# EAGLE schematic MotherboardRev1 (EAGLE 7.2.0)

## Sheet 1 of 9
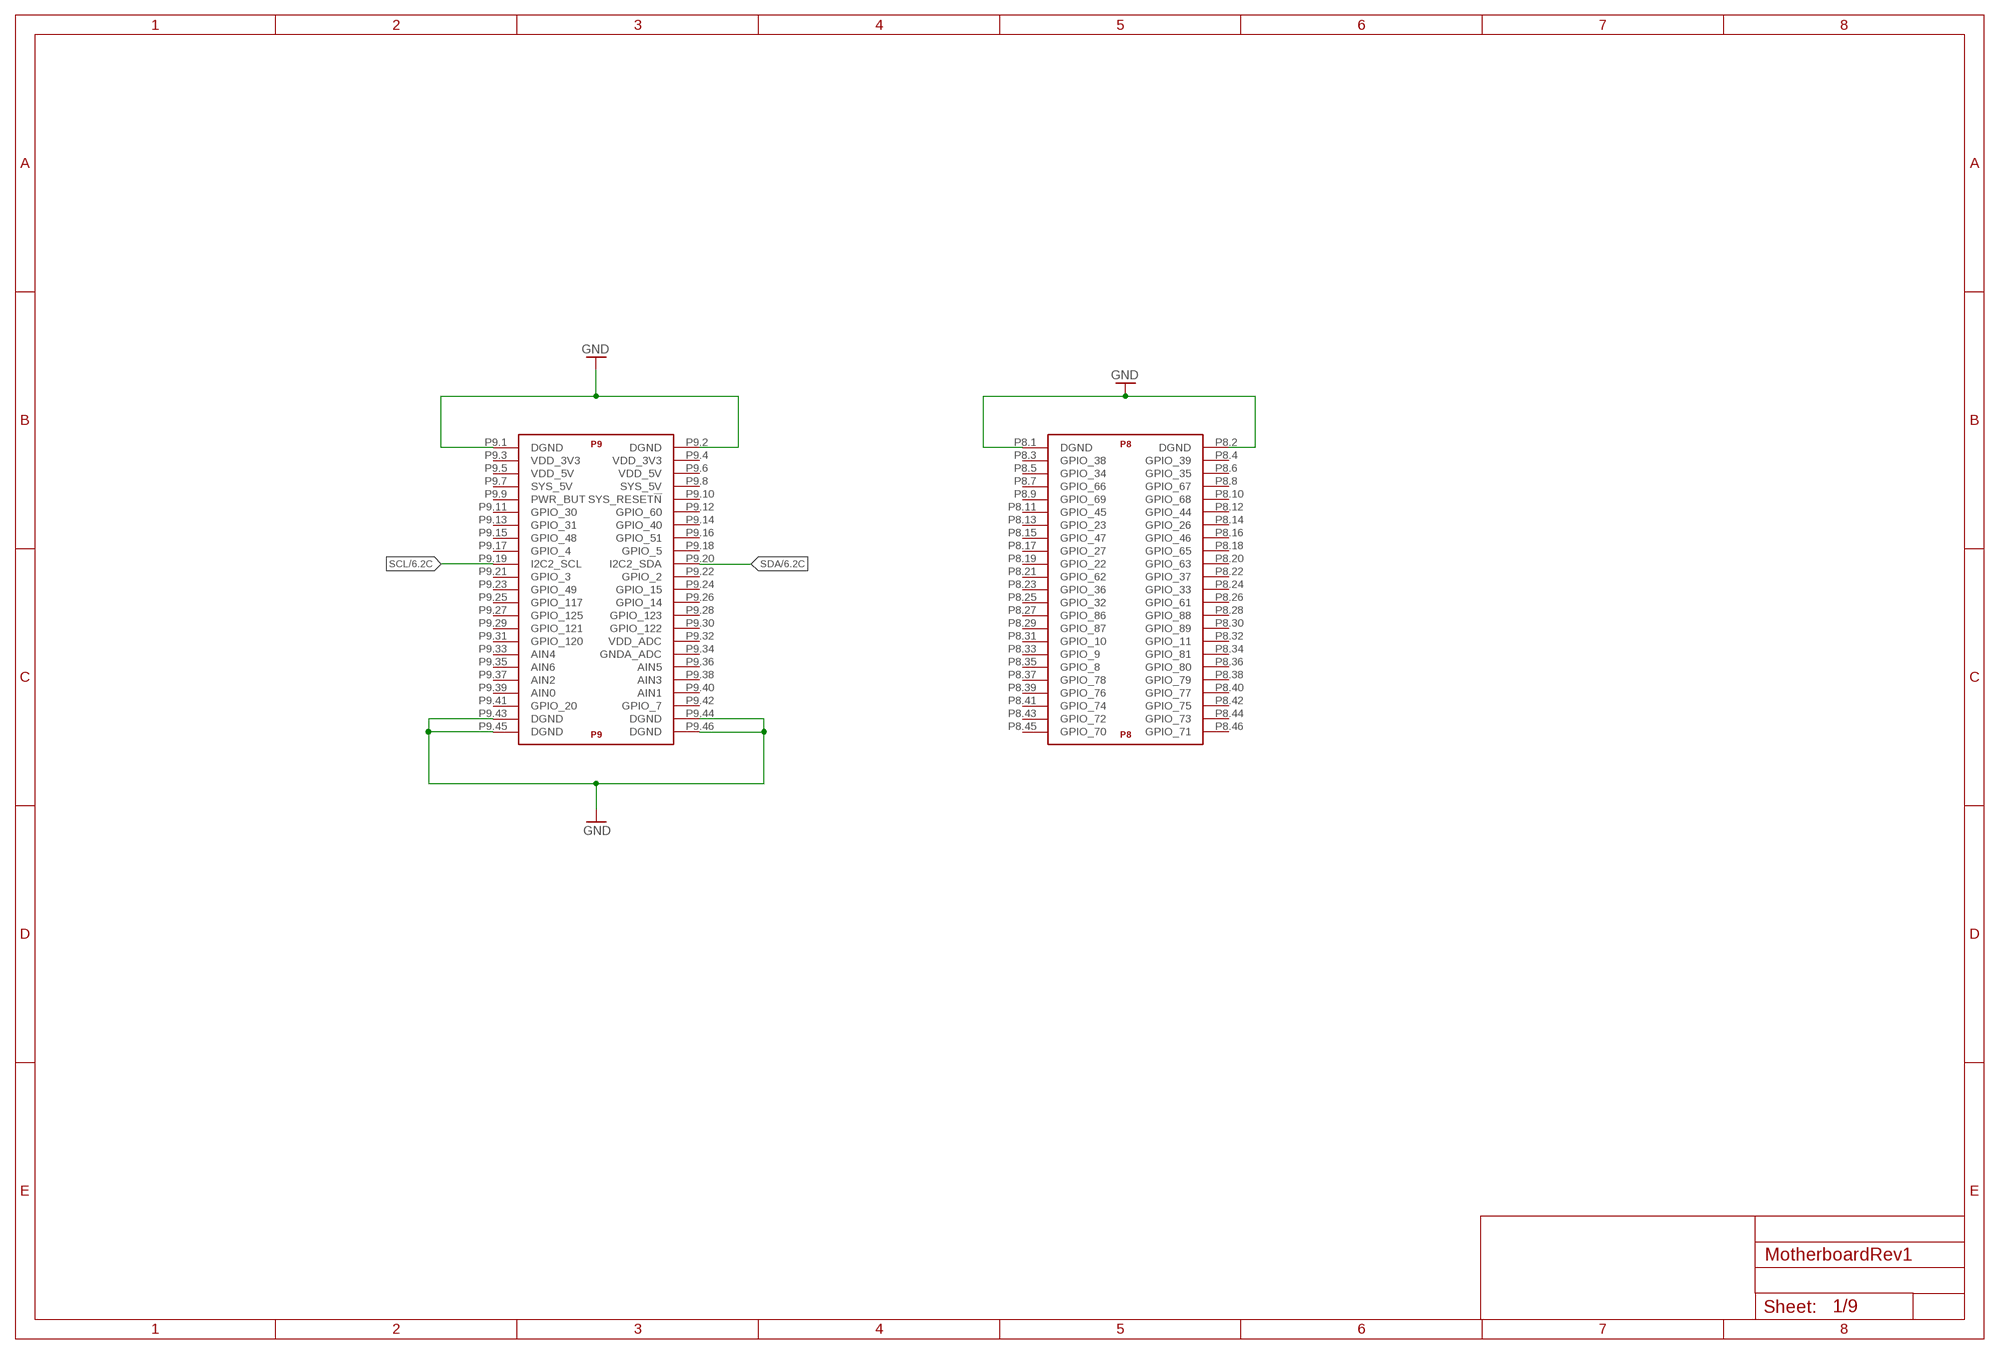
[diagram p0: schematic, sheet 1]

### Parts
U$1  BEAGLE_BONE_BLACK_CAPE  [BEAGLE_BONE_BLACK_CAPE]

### Nets
GND: U$1.P8.1(P8:DGND) U$1.P8.2(P8:DGND) U$1.P9.1(P9:DGND) U$1.P9.2(P9:DGND) U$1.P9.43(P9:DGND) U$1.P9.44(P9:DGND) U$1.P9.45(P9:DGND) U$1.P9.46(P9:DGND) ; also sheet 2,3,4,5,6,8,9
SCL: U$1.P9.19(P9:I2C2_SCL) ; also sheet 6,9
SDA: U$1.P9.20(P9:I2C2_SDA) ; also sheet 6,9
Unconnected: U$1.P8.3(P8:GPIO_38) U$1.P8.4(P8:GPIO_39) U$1.P8.5(P8:GPIO_34) U$1.P8.6(P8:GPIO_35) U$1.P8.7(P8:GPIO_66) U$1.P8.8(P8:GPIO_67) U$1.P8.9(P8:GPIO_69) U$1.P8.10(P8:GPIO_68) U$1.P8.11(P8:GPIO_45) U$1.P8.12(P8:GPIO_44) U$1.P8.13(P8:GPIO_23) U$1.P8.14(P8:GPIO_26) U$1.P8.15(P8:GPIO_47) U$1.P8.16(P8:GPIO_46) U$1.P8.17(P8:GPIO_27) U$1.P8.18(P8:GPIO_65) U$1.P8.19(P8:GPIO_22) U$1.P8.20(P8:GPIO_63) U$1.P8.21(P8:GPIO_62) U$1.P8.22(P8:GPIO_37) U$1.P8.23(P8:GPIO_36) U$1.P8.24(P8:GPIO_33) U$1.P8.25(P8:GPIO_32) U$1.P8.26(P8:GPIO_61) U$1.P8.27(P8:GPIO_86) U$1.P8.28(P8:GPIO_88) U$1.P8.29(P8:GPIO_87) U$1.P8.30(P8:GPIO_89) U$1.P8.31(P8:GPIO_10) U$1.P8.32(P8:GPIO_11) U$1.P8.33(P8:GPIO_9) U$1.P8.34(P8:GPIO_81) U$1.P8.35(P8:GPIO_8) U$1.P8.36(P8:GPIO_80) U$1.P8.37(P8:GPIO_78) U$1.P8.38(P8:GPIO_79) U$1.P8.39(P8:GPIO_76) U$1.P8.40(P8:GPIO_77) U$1.P8.41(P8:GPIO_74) U$1.P8.42(P8:GPIO_75) U$1.P8.43(P8:GPIO_72) U$1.P8.44(P8:GPIO_73) U$1.P8.45(P8:GPIO_70) U$1.P8.46(P8:GPIO_71) U$1.P9.3(P9:VDD_3V3) U$1.P9.4(P9:VDD_3V3) U$1.P9.5(P9:VDD_5V) U$1.P9.6(P9:VDD_5V) U$1.P9.7(P9:SYS_5V) U$1.P9.8(P9:SYS_5V) U$1.P9.9(P9:PWR_BUT) U$1.P9.10(P9:SYS_RESET!N) U$1.P9.11(P9:GPIO_30) U$1.P9.12(P9:GPIO_60) U$1.P9.13(P9:GPIO_31) U$1.P9.14(P9:GPIO_40) U$1.P9.15(P9:GPIO_48) U$1.P9.16(P9:GPIO_51) U$1.P9.17(P9:GPIO_4) U$1.P9.18(P9:GPIO_5) U$1.P9.21(P9:GPIO_3) U$1.P9.22(P9:GPIO_2) U$1.P9.23(P9:GPIO_49) U$1.P9.24(P9:GPIO_15) U$1.P9.25(P9:GPIO_117) U$1.P9.26(P9:GPIO_14) U$1.P9.27(P9:GPIO_125) U$1.P9.28(P9:GPIO_123) U$1.P9.29(P9:GPIO_121) U$1.P9.30(P9:GPIO_122) U$1.P9.31(P9:GPIO_120) U$1.P9.32(P9:VDD_ADC) U$1.P9.33(P9:AIN4) U$1.P9.34(P9:GNDA_ADC) U$1.P9.35(P9:AIN6) U$1.P9.36(P9:AIN5) U$1.P9.37(P9:AIN2) U$1.P9.38(P9:AIN3) U$1.P9.39(P9:AIN0) U$1.P9.40(P9:AIN1) U$1.P9.41(P9:GPIO_20) U$1.P9.42(P9:GPIO_7)

## Sheet 2 of 9
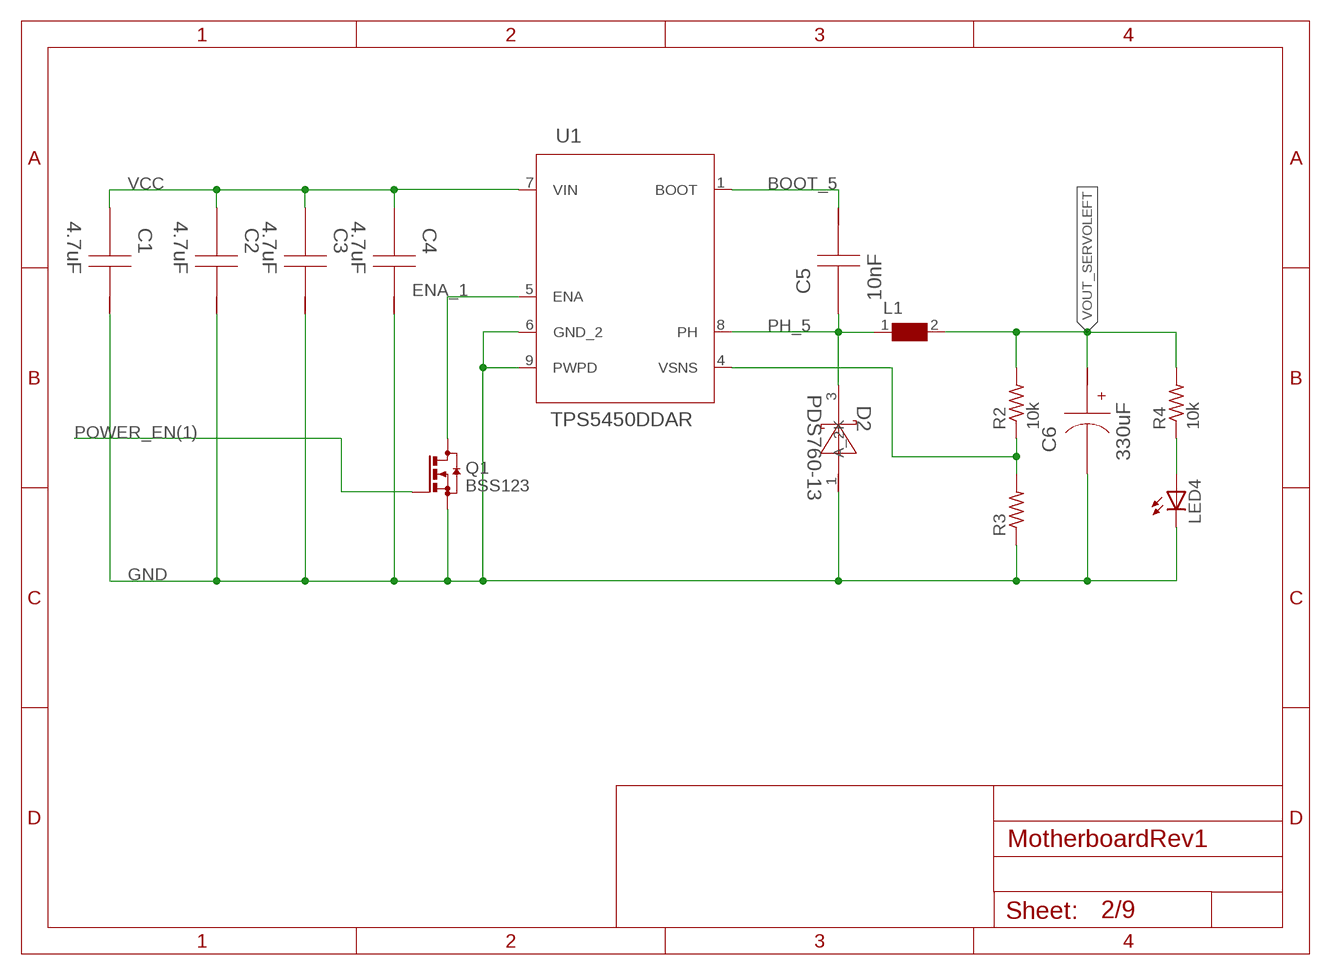
[diagram p1: schematic, sheet 2]

### Parts
C1  4.7uF  GRM31CR71H475KA12L  [1206]
C2  4.7uF  GRM31CR71H475KA12L  [1206]
C3  4.7uF  GRM31CR71H475KA12L  [1206]
C4  4.7uF  GRM31CR71H475KA12L  [1206]
C5  10nF  C0805C103K5RACTU  [0805]
C6  330uF  10SVP330MX  [SM_RADIAL_10AMM]
D2  PDS760-13  [POWERDI5]
L1  WE-HCC-7443331000_1090  [WE-HCC_1090]
LED4  LEDSML1206  [SML1206]
Q1  BSS123  [SOT23]
R2  10k  R-US_R1206  [R1206]
R3  R-US_R1206  [R1206]
R4  10k  R-US_R1206  [R1206]
U1  TPS5450DDAR  [R-PDSO-G8]

### Nets
BOOT_5: C5.1 U1.1(BOOT) ; also sheet 4
ENA_1: Q1.3(D) U1.5(ENA)
GND: C1.1 C2.1 C3.1 C4.1 C6.2(-) D2.1(A_2) LED4.C Q1.2(S) R3.1 U1.6(GND_2) U1.9(PWPD) ; also sheet 1,3,4,5,6,8,9
N$2: LED4.A R4.1
PH_5: C5.2 D2.3(K) L1.1 U1.8(PH) ; also sheet 4
POWER_EN(1): Q1.1(G)
VCC: C1.2 C2.2 C3.2 C4.2 U1.7(VIN) ; also sheet 3,4,5
VOUT_SERVOLEFT: C6.1(+) L1.2 R2.2 R4.2 ; also sheet 8
VSNS_5: R2.1 R3.2 U1.4(VSNS)

## Sheet 3 of 9
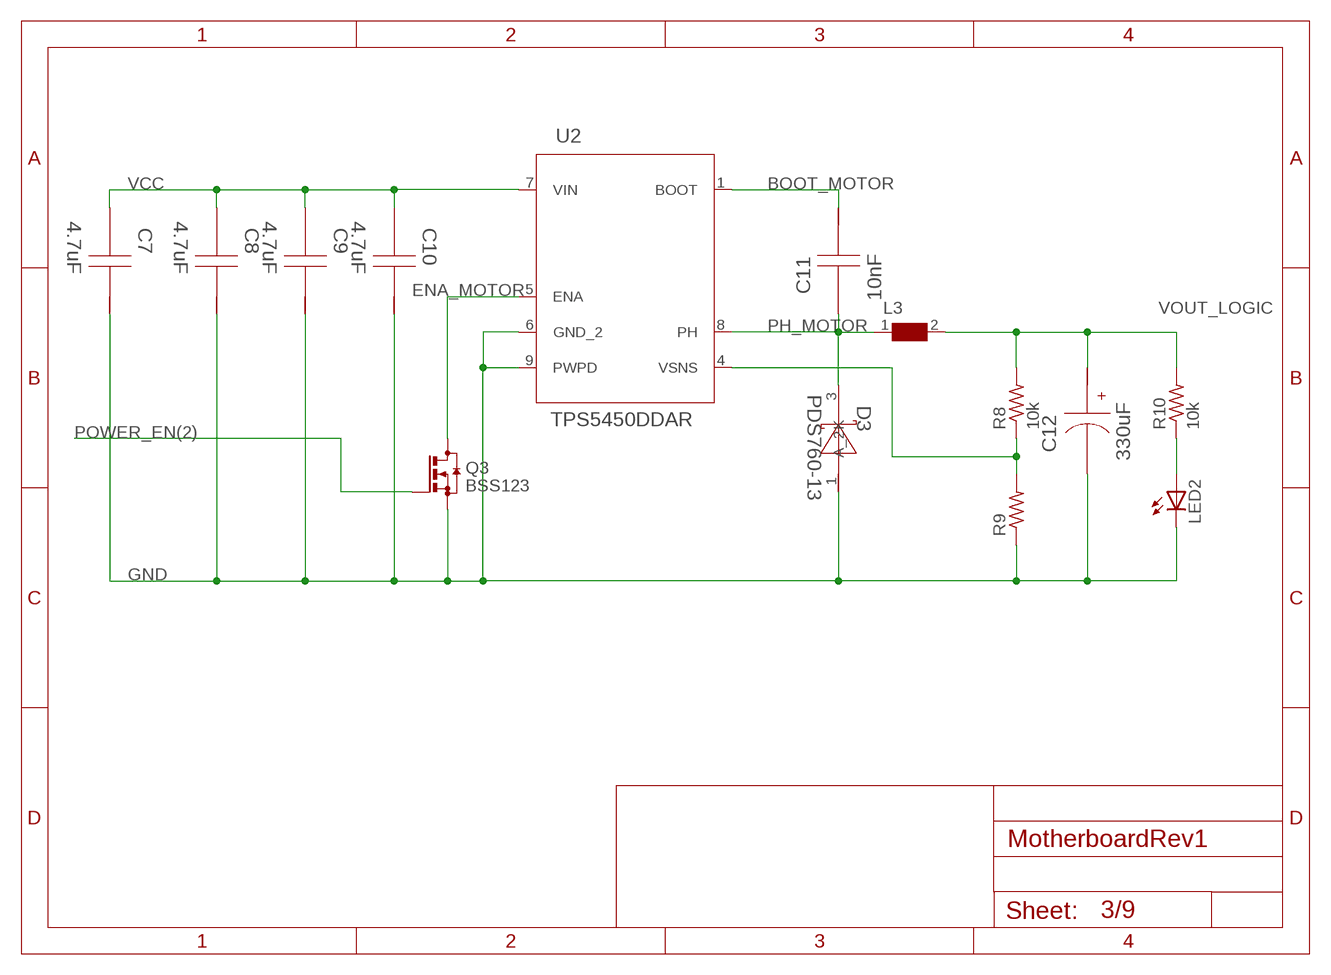
[diagram p2: schematic, sheet 3]

### Parts
C7  4.7uF  GRM31CR71H475KA12L  [1206]
C8  4.7uF  GRM31CR71H475KA12L  [1206]
C9  4.7uF  GRM31CR71H475KA12L  [1206]
C10  4.7uF  GRM31CR71H475KA12L  [1206]
C11  10nF  C0805C103K5RACTU  [0805]
C12  330uF  10SVP330MX  [SM_RADIAL_10AMM]
D3  PDS760-13  [POWERDI5]
L3  WE-HCC-7443331000_1090  [WE-HCC_1090]
LED2  LEDSML1206  [SML1206]
Q3  BSS123  [SOT23]
R8  10k  R-US_R1206  [R1206]
R9  R-US_R1206  [R1206]
R10  10k  R-US_R1206  [R1206]
U2  TPS5450DDAR  [R-PDSO-G8]

### Nets
BOOT_MOTOR: C11.1 U2.1(BOOT) ; also sheet 5
ENA_MOTOR: Q3.3(D) U2.5(ENA) ; also sheet 5
GND: C7.1 C8.1 C9.1 C10.1 C12.2(-) D3.1(A_2) LED2.C Q3.2(S) R9.1 U2.6(GND_2) U2.9(PWPD) ; also sheet 1,2,4,5,6,8,9
N$4: LED2.A R10.1
PH_MOTOR: C11.2 D3.3(K) L3.1 U2.8(PH) ; also sheet 5
POWER_EN(2): Q3.1(G)
VCC: C7.2 C8.2 C9.2 C10.2 U2.7(VIN) ; also sheet 2,4,5
VOUT_LOGIC: C12.1(+) L3.2 R8.2 R10.2
VSNS1_MOTOR: R8.1 R9.2 U2.4(VSNS)

## Sheet 4 of 9
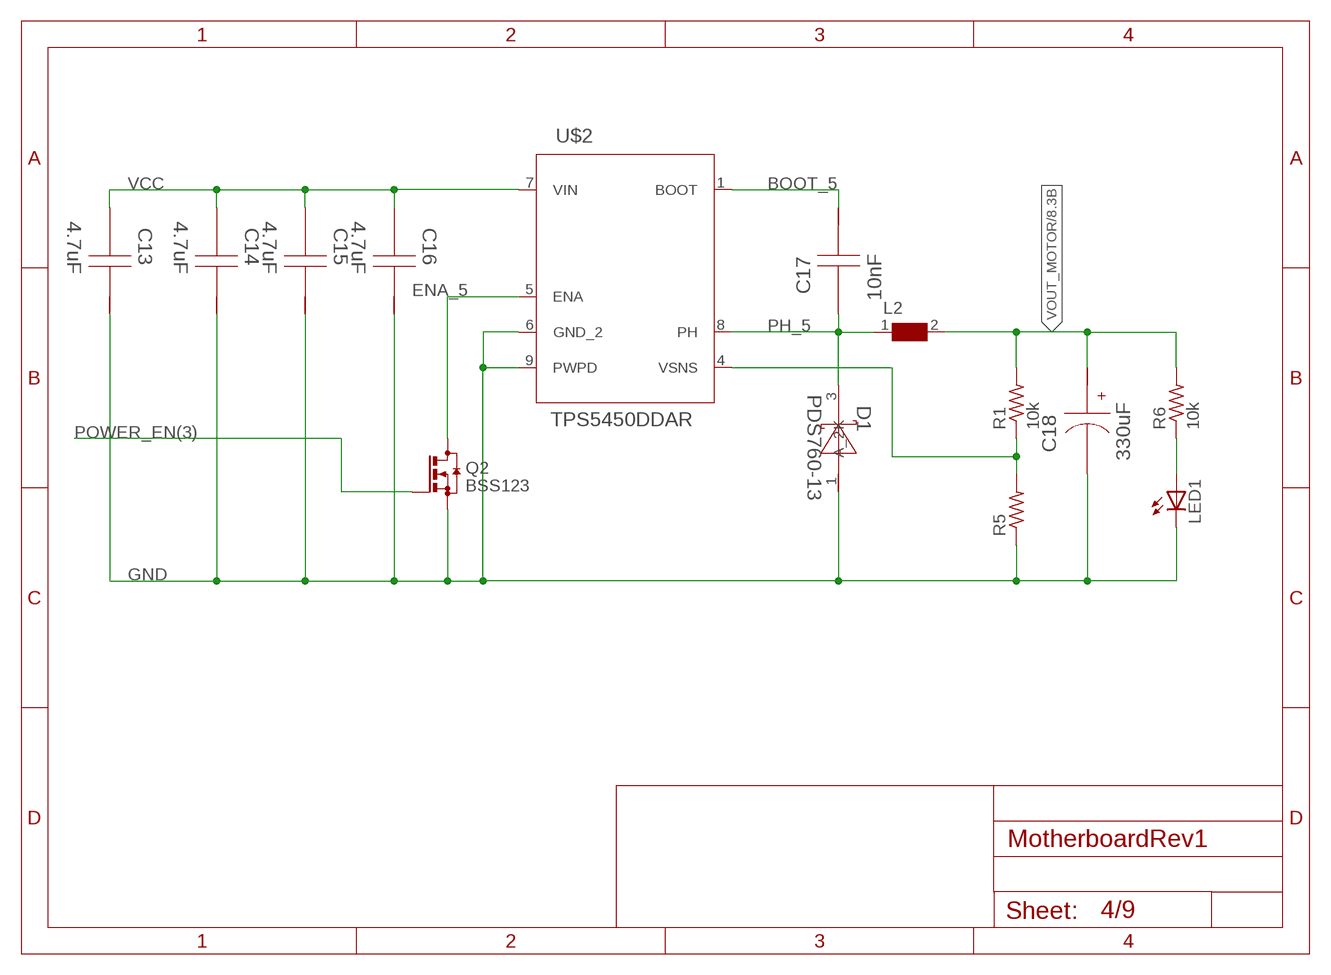
[diagram p3: schematic, sheet 4]

### Parts
C13  4.7uF  GRM31CR71H475KA12L  [1206]
C14  4.7uF  GRM31CR71H475KA12L  [1206]
C15  4.7uF  GRM31CR71H475KA12L  [1206]
C16  4.7uF  GRM31CR71H475KA12L  [1206]
C17  10nF  C0805C103K5RACTU  [0805]
C18  330uF  10SVP330MX  [SM_RADIAL_10AMM]
D1  PDS760-13  [POWERDI5]
L2  WE-HCC-7443331000_1090  [WE-HCC_1090]
LED1  LEDSML1206  [SML1206]
Q2  BSS123  [SOT23]
R1  10k  R-US_R1206  [R1206]
R5  R-US_R1206  [R1206]
R6  10k  R-US_R1206  [R1206]
U$2  TPS5450DDAR  [R-PDSO-G8]

### Nets
BOOT_5: C17.1 U$2.1(BOOT) ; also sheet 2
ENA_5: Q2.3(D) U$2.5(ENA)
GND: C13.1 C14.1 C15.1 C16.1 C18.2(-) D1.1(A_2) LED1.C Q2.2(S) R5.1 U$2.6(GND_2) U$2.9(PWPD) ; also sheet 1,2,3,5,6,8,9
N$1: LED1.A R6.1
PH_5: C17.2 D1.3(K) L2.1 U$2.8(PH) ; also sheet 2
POWER_EN(3): Q2.1(G)
VCC: C13.2 C14.2 C15.2 C16.2 U$2.7(VIN) ; also sheet 2,3,5
VOUT_MOTOR: C18.1(+) L2.2 R1.2 R6.2 ; also sheet 8
VSNS_1: R1.1 R5.2 U$2.4(VSNS)

## Sheet 5 of 9
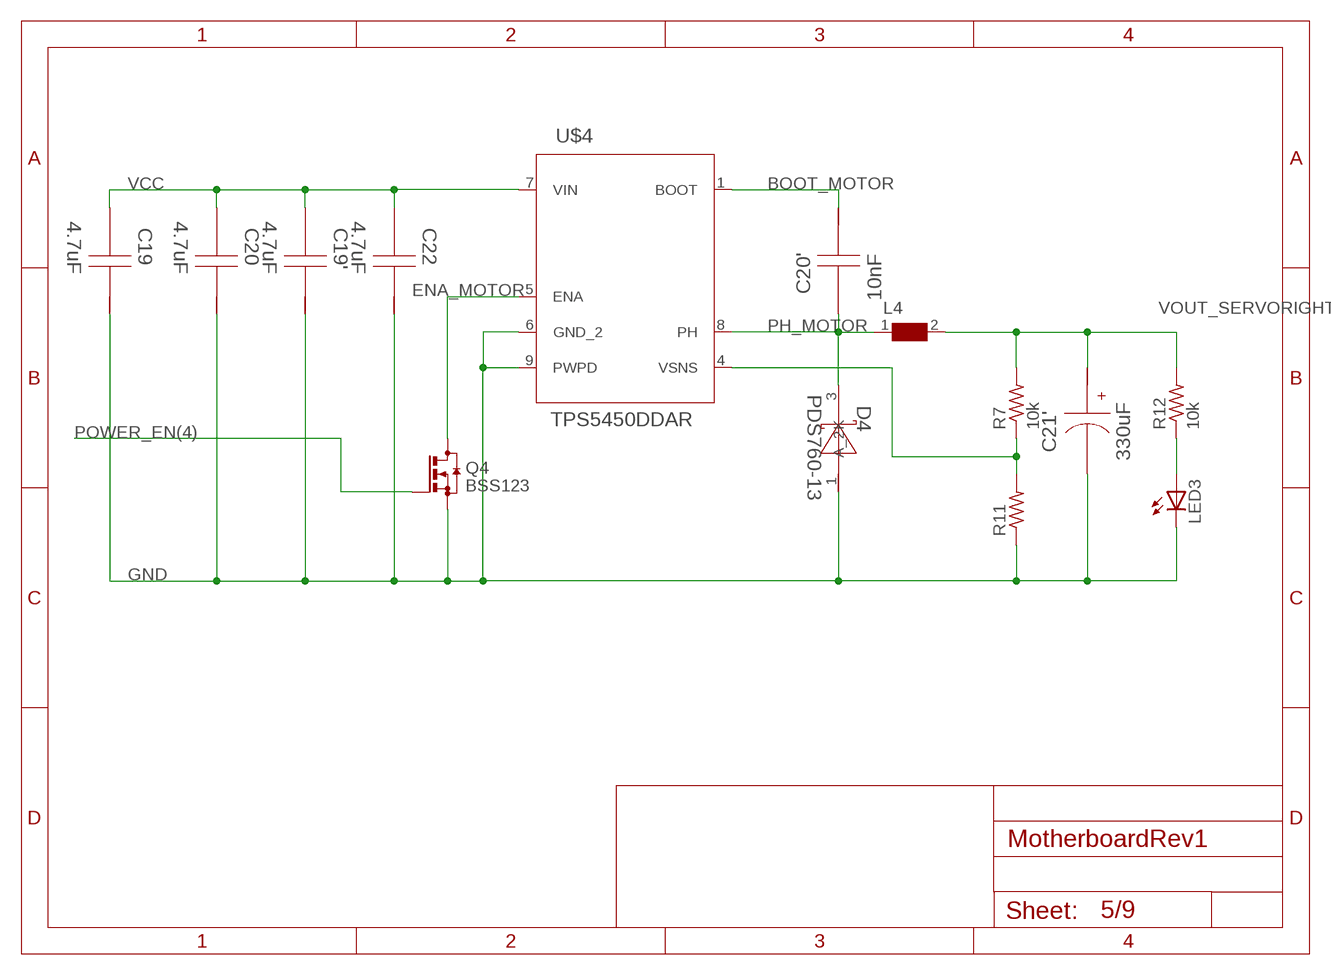
[diagram p4: schematic, sheet 5]

### Parts
C19  4.7uF  GRM31CR71H475KA12L  [1206]
C19'  4.7uF  GRM31CR71H475KA12L  [1206]
C20  4.7uF  GRM31CR71H475KA12L  [1206]
C20'  10nF  C0805C103K5RACTU  [0805]
C21'  330uF  10SVP330MX  [SM_RADIAL_10AMM]
C22  4.7uF  GRM31CR71H475KA12L  [1206]
D4  PDS760-13  [POWERDI5]
L4  WE-HCC-7443331000_1090  [WE-HCC_1090]
LED3  LEDSML1206  [SML1206]
Q4  BSS123  [SOT23]
R7  10k  R-US_R1206  [R1206]
R11  R-US_R1206  [R1206]
R12  10k  R-US_R1206  [R1206]
U$4  TPS5450DDAR  [R-PDSO-G8]

### Nets
BOOT_MOTOR: C20'.1 U$4.1(BOOT) ; also sheet 3
ENA_MOTOR: Q4.3(D) U$4.5(ENA) ; also sheet 3
GND: C19'.1 C19.1 C20.1 C21'.2(-) C22.1 D4.1(A_2) LED3.C Q4.2(S) R11.1 U$4.6(GND_2) U$4.9(PWPD) ; also sheet 1,2,3,4,6,8,9
N$3: LED3.A R12.1
PH_MOTOR: C20'.2 D4.3(K) L4.1 U$4.8(PH) ; also sheet 3
POWER_EN(4): Q4.1(G)
VCC: C19'.2 C19.2 C20.2 C22.2 U$4.7(VIN) ; also sheet 2,3,4
VOUT_SERVORIGHT: C21'.1(+) L4.2 R7.2 R12.2 ; also sheet 8
VSNS1_MOTOR1: R7.1 R11.2 U$4.4(VSNS)

## Sheet 6 of 9
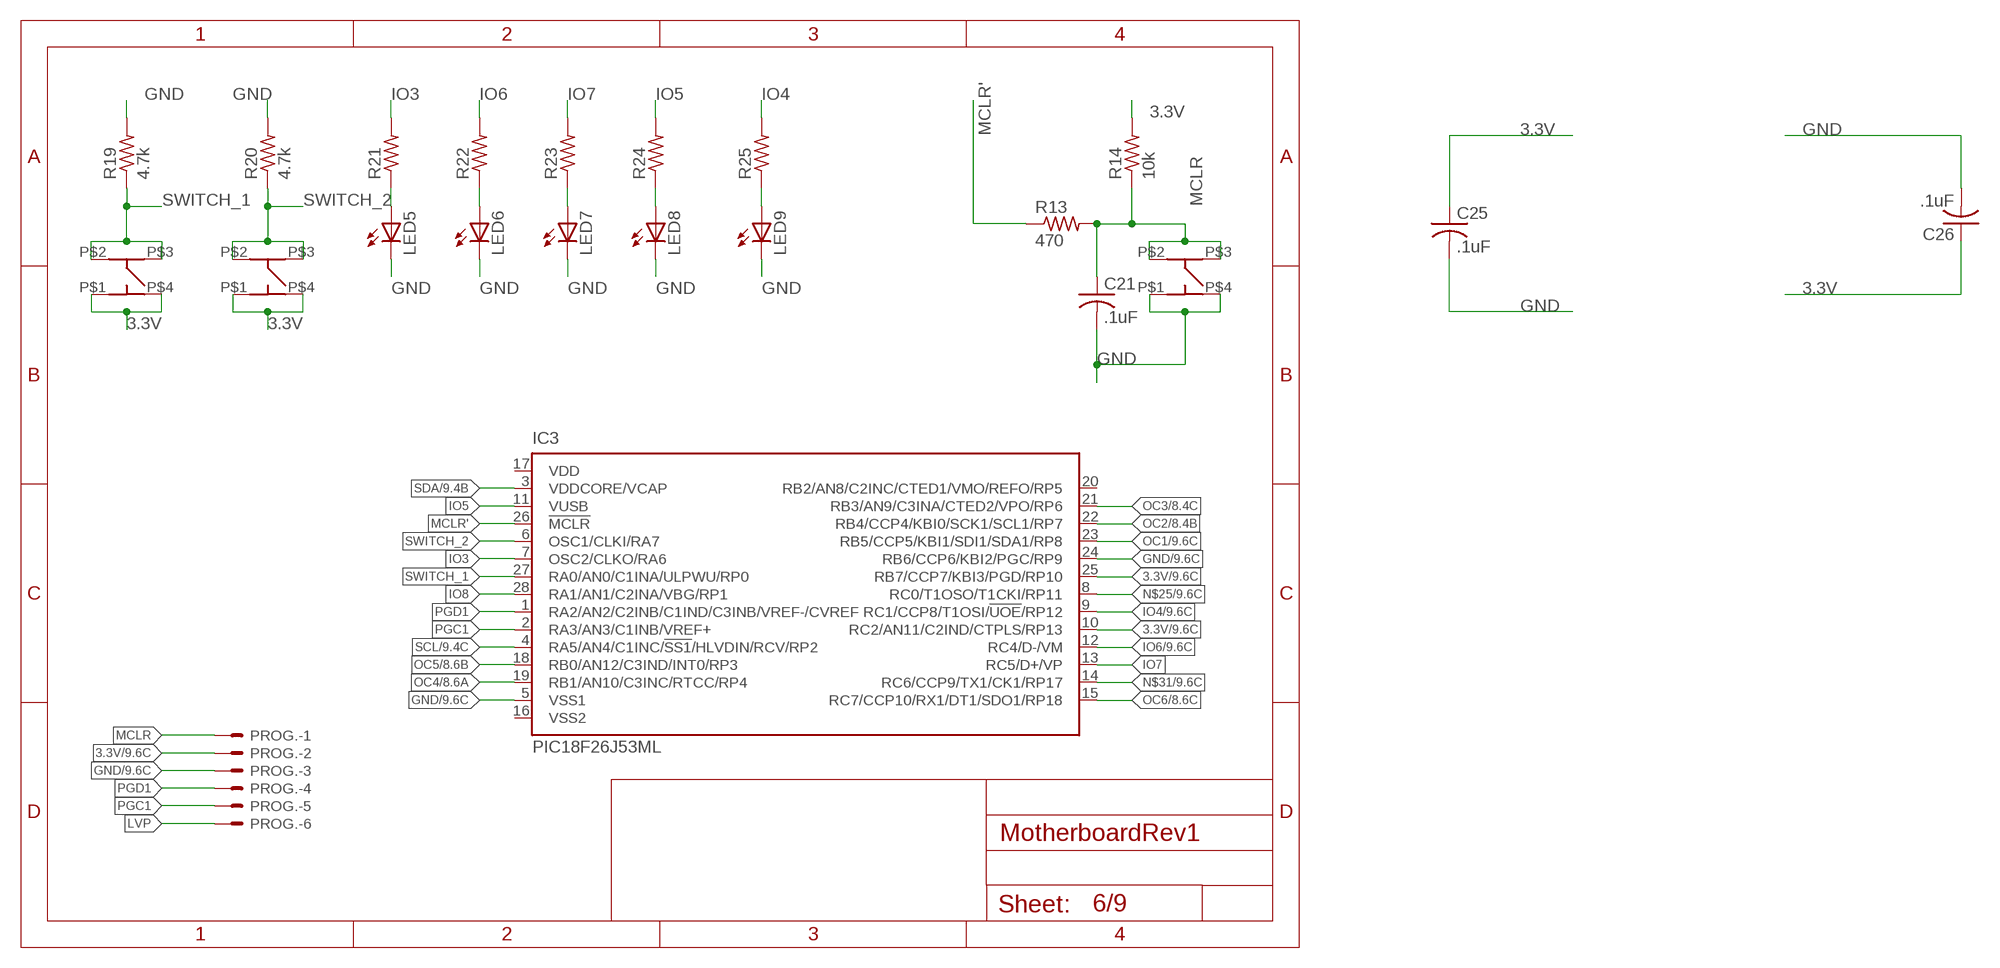
[diagram p5: schematic, sheet 6]

### Parts
C21  .1uF  C-USC0805  [C0805]
C25  .1uF  C-USC0805  [C0805]
C26  .1uF  C-USC0805  [C0805]
IC3  PIC18F26J53ML  [QFN28-ML_6X6MM]
LED5  LED_LEDCHIPLED_1206  [LED_CHIPLED_1206]
LED6  LED_LEDCHIPLED_1206  [LED_CHIPLED_1206]
LED7  LED_LEDCHIPLED_1206  [LED_CHIPLED_1206]
LED8  LED_LEDCHIPLED_1206  [LED_CHIPLED_1206]
LED9  LED_LEDCHIPLED_1206  [LED_CHIPLED_1206]
PROG.  22-23-2061  [22-23-2061]
R13  470  R-US_R0805  [R0805]
R14  10k  R-US_R0805  [R0805]
R19  4.7k  R-US_R0805  [R0805]
R20  4.7k  R-US_R0805  [R0805]
R21  R-US_M0805  [M0805]
R22  R-US_M0805  [M0805]
R23  R-US_M0805  [M0805]
R24  R-US_M0805  [M0805]
R25  R-US_M0805  [M0805]
U$5  Switch3  MC32882_SW  [MC32882_FINAL]
U$6  Switch1  MC32882_SW  [MC32882_FINAL]
U$7  Switch2  MC32882_SW  [MC32882_FINAL]

### Nets
3.3V: C25.1 C26.1 IC3.10(RC2/AN11/C2IND/CTPLS/RP13) IC3.25(RB7/CCP7/KBI3/PGD/RP10) PROG..2 R14.2 U$6.P$1(P1) U$6.P$4(P4) U$7.P$1(P1) U$7.P$4(P4) ; also sheet 7,9
GND: C21.2 C25.2 C26.2 IC3.5(VSS1) IC3.24(RB6/CCP6/KBI2/PGC/RP9) LED5.C LED6.C LED7.C LED8.C LED9.C PROG..3 R19.2 R20.2 U$5.P$1(P1) U$5.P$4(P4) ; also sheet 1,2,3,4,5,8,9
IO3: IC3.7(OSC2/CLKO/RA6) R21.2
IO4: IC3.9(RC1/CCP8/T1OSI/!UOE!/RP12) R25.2 ; also sheet 9
IO5: IC3.11(VUSB) R24.2
IO6: IC3.12(RC4/D-/VM) R22.2 ; also sheet 9
IO7: IC3.13(RC5/D+/VP) R23.2
IO8: IC3.28(RA1/AN1/C2INA/VBG/RP1)
LVP: PROG..6
MCLR: C21.1 PROG..1 R13.2 R14.1 U$5.P$2(P2) U$5.P$3(P3)
MCLR': IC3.26(!MCLR) R13.1
N$5: LED5.A R21.1
N$6: LED6.A R22.1
N$7: LED7.A R23.1
N$8: LED8.A R24.1
N$9: LED9.A R25.1
N$25: IC3.8(RC0/T1OSO/T1CKI/RP11) ; also sheet 9
N$31: IC3.14(RC6/CCP9/TX1/CK1/RP17) ; also sheet 9
OC1: IC3.23(RB5/CCP5/KBI1/SDI1/SDA1/RP8) ; also sheet 8,9
OC2: IC3.22(RB4/CCP4/KBI0/SCK1/SCL1/RP7) ; also sheet 8,9
OC3: IC3.21(RB3/AN9/C3INA/CTED2/VPO/RP6) ; also sheet 8,9
OC4: IC3.19(RB1/AN10/C3INC/RTCC/RP4) ; also sheet 8
OC5: IC3.18(RB0/AN12/C3IND/INT0/RP3) ; also sheet 8
OC6: IC3.15(RC7/CCP10/RX1/DT1/SDO1/RP18) ; also sheet 8
PGC1: IC3.2(RA3/AN3/C1INB/VREF+) PROG..5
PGD1: IC3.1(RA2/AN2/C2INB/C1IND/C3INB/VREF-/CVREF) PROG..4
SCL: IC3.4(RA5/AN4/C1INC/!SS1!/HLVDIN/RCV/RP2) ; also sheet 1,9
SDA: IC3.3(VDDCORE/VCAP) ; also sheet 1,9
SWITCH_1: IC3.27(RA0/AN0/C1INA/ULPWU/RP0) R19.1 U$6.P$2(P2) U$6.P$3(P3)
SWITCH_2: IC3.6(OSC1/CLKI/RA7) R20.1 U$7.P$2(P2) U$7.P$3(P3)
Unconnected: IC3.16(VSS2) IC3.17(VDD) IC3.20(RB2/AN8/C2INC/CTED1/VMO/REFO/RP5)

## Sheet 7 of 9: Power System
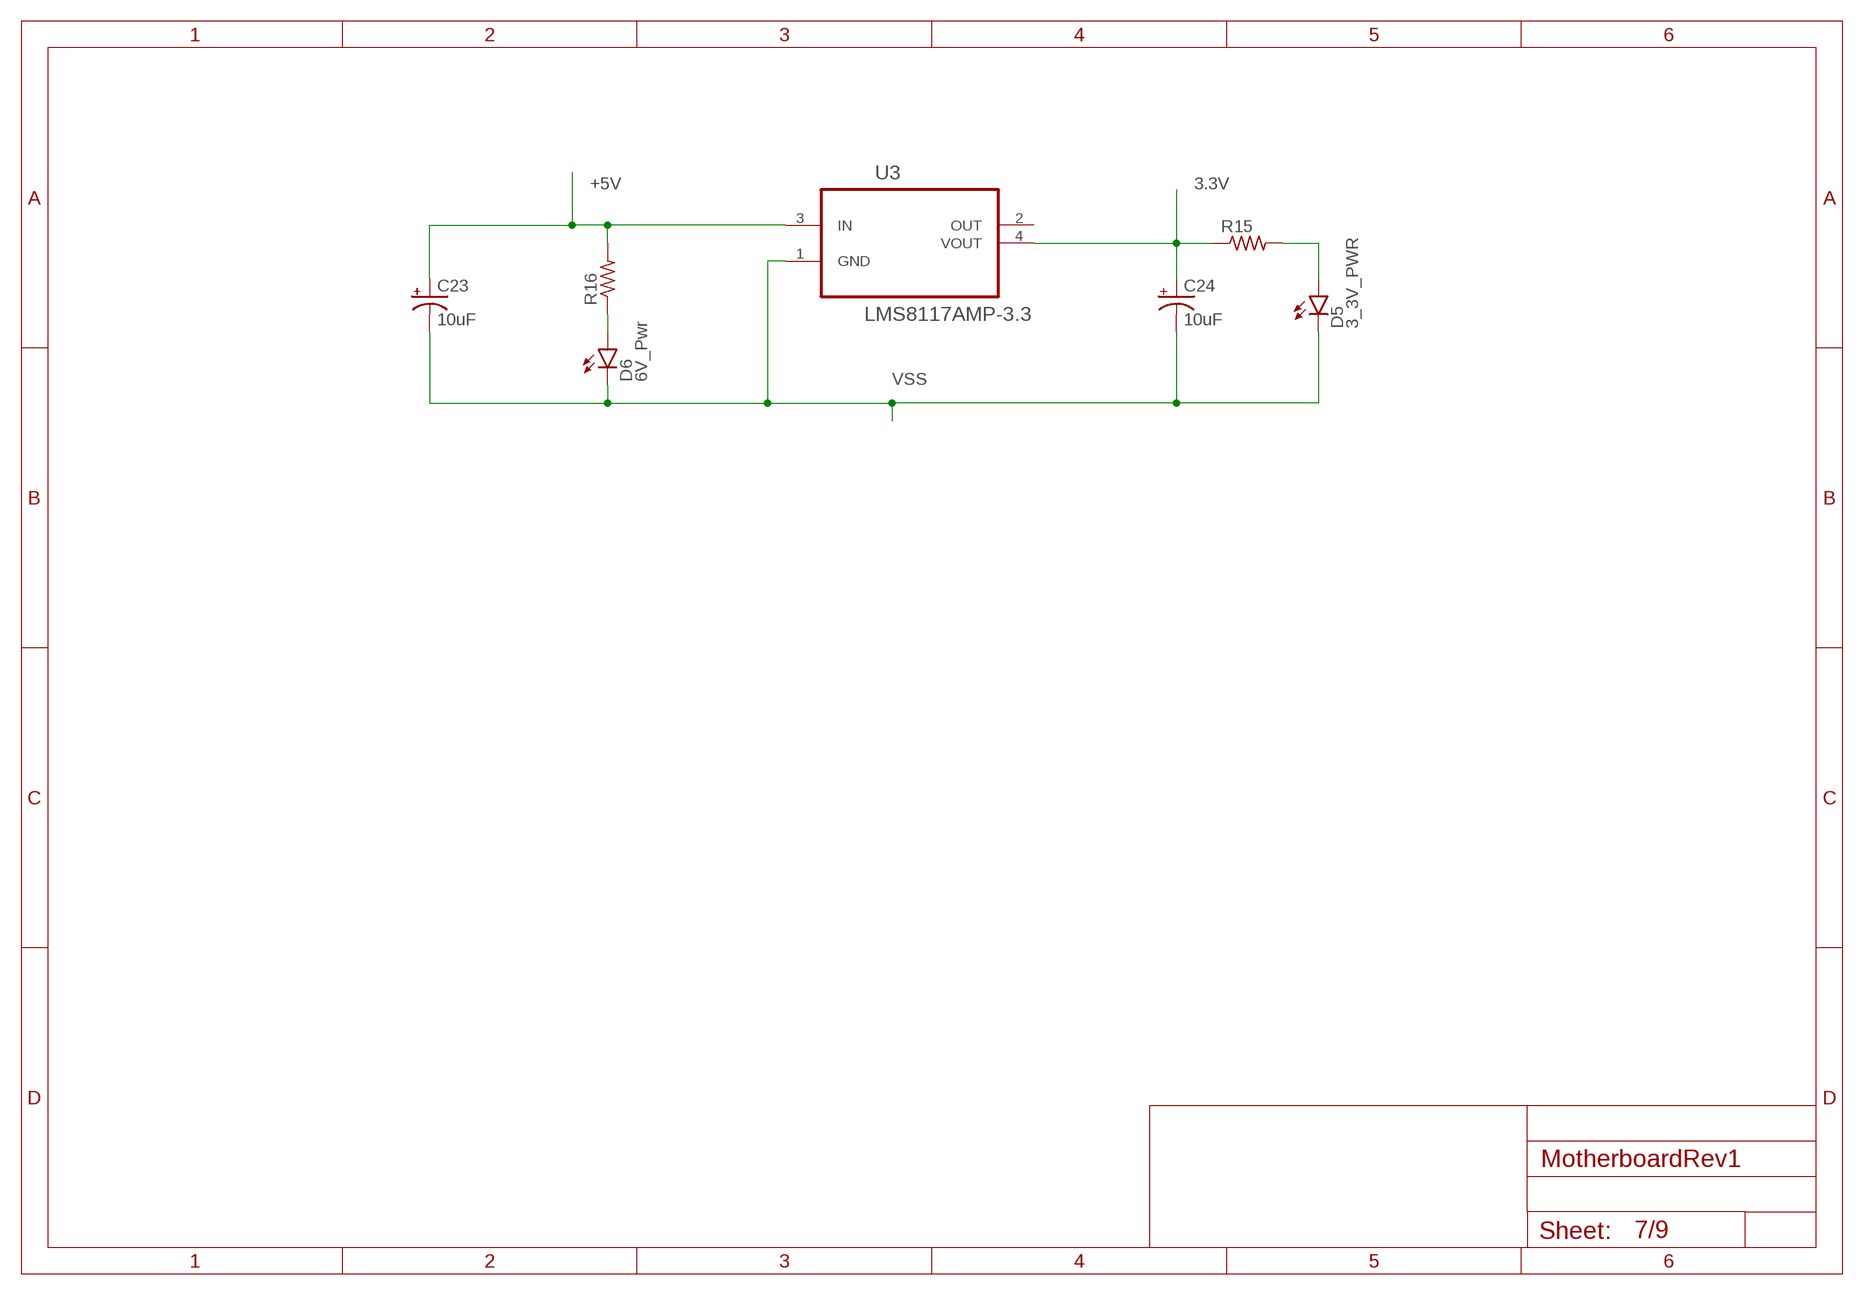
[diagram p6: schematic, sheet 7]

### Parts
C23  10uF  10UF-16V-10%(TANT)  [EIA3216]
C24  10uF  10UF-16V-10%(TANT)  [EIA3216]
D5  3_3V_PWR  LED-FKIT-1206  [FKIT-LED-1206]
D6  6V_Pwr  LED-FKIT-1206  [FKIT-LED-1206]
R15  R-US_R0805W  [R0805W]
R16  R-US_R0805W  [R0805W]
U3  LMS8117AMP-3.3  [SOT230P696X180-4N]

### Nets
3.3V: C24.A(+) R15.1 U3.4(VOUT) ; also sheet 6,9
+5V: C23.A(+) R16.2 U3.3(IN)
N$10: D5.A R15.2
N$13: D6.A R16.1
VSS: C23.C(-) C24.C(-) D5.C D6.C U3.1(GND) ; also sheet 8
Unconnected: U3.2(OUT)

## Sheet 8 of 9
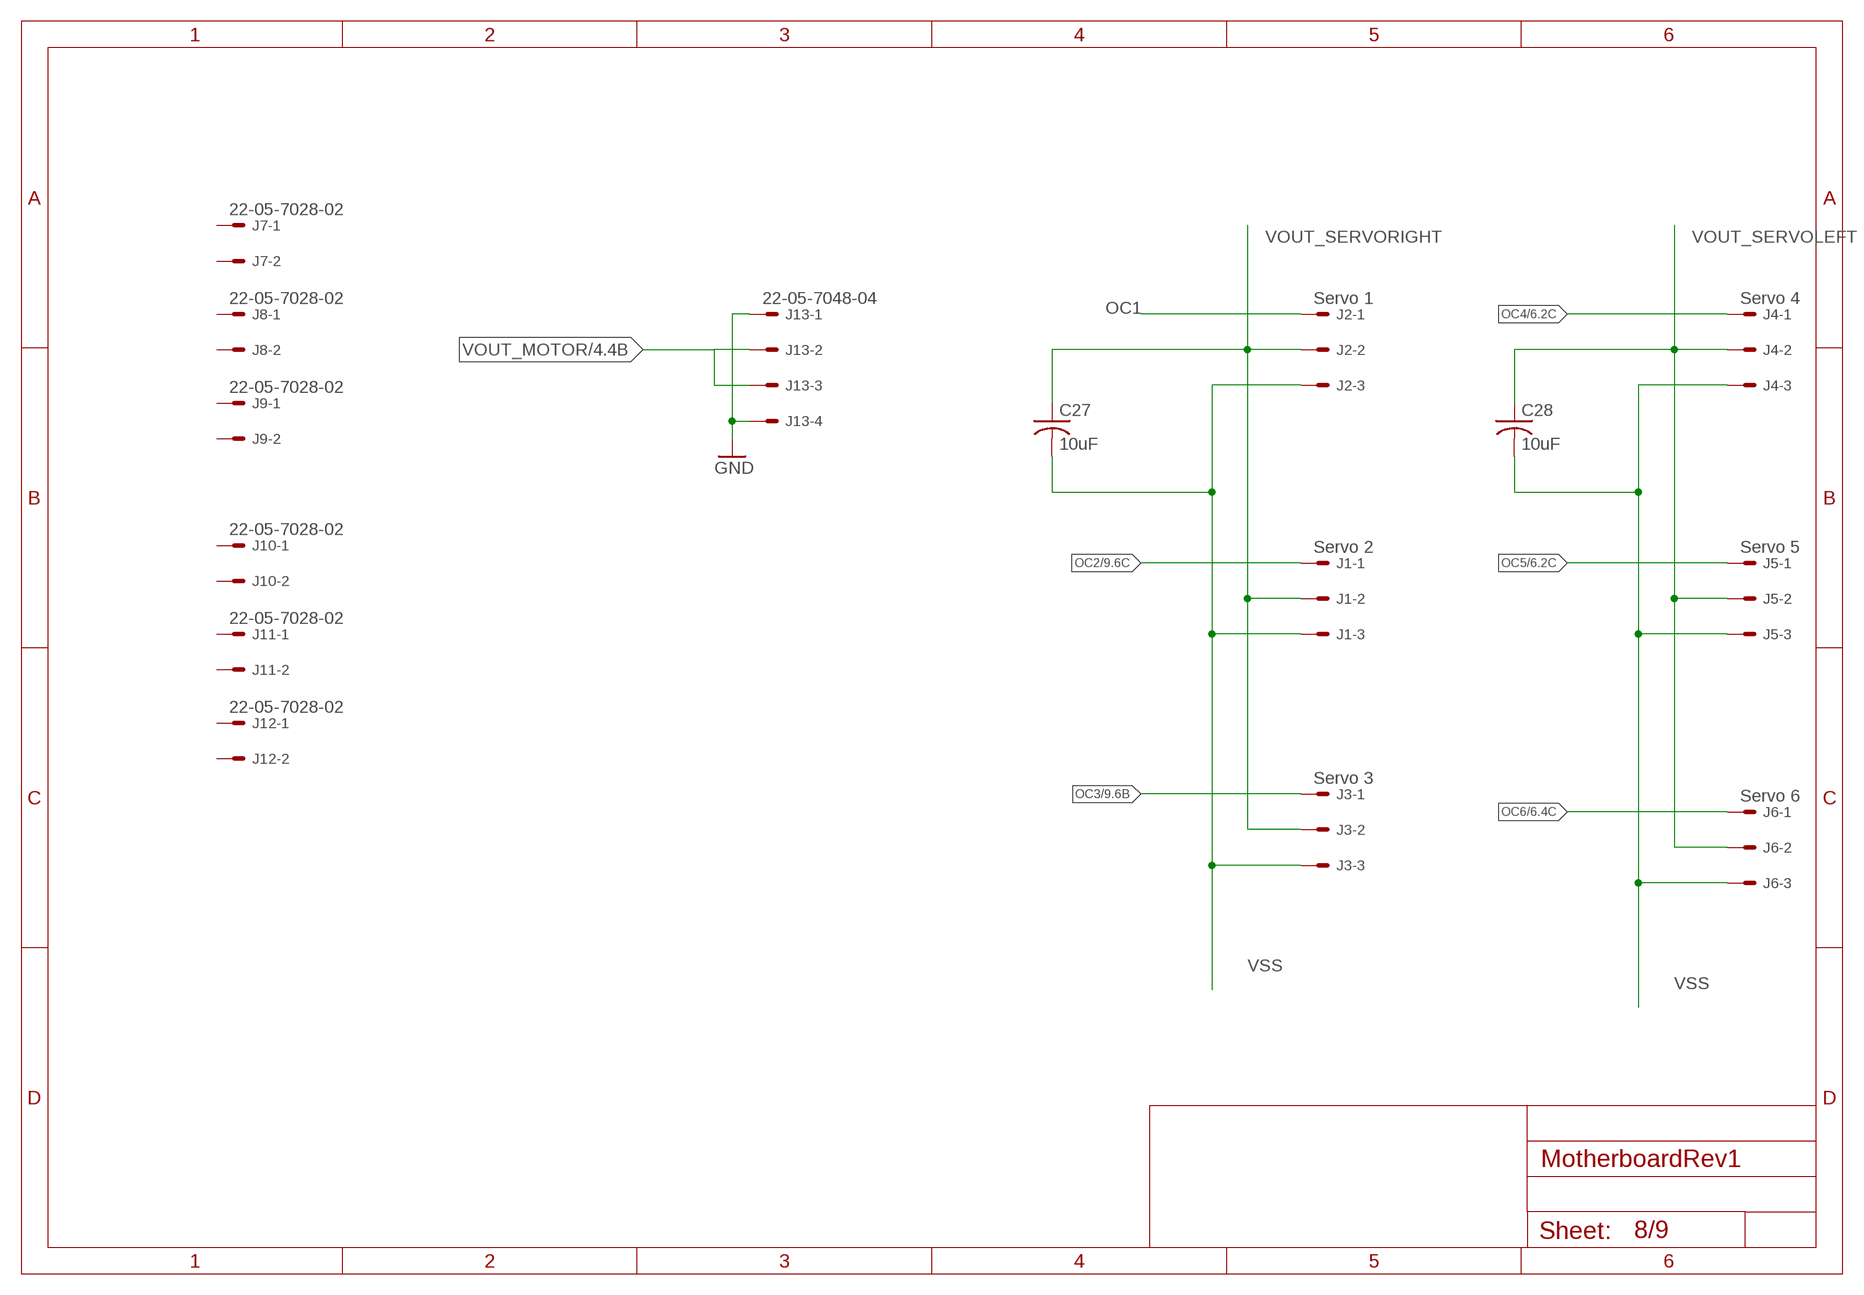
[diagram p7: schematic, sheet 8]

### Parts
C27  10uF  C-USC0805  [C0805]
C28  10uF  C-USC0805  [C0805]
J1  Servo 2  22-05-7038-03  [7395-03]
J2  Servo 1  22-05-7038-03  [7395-03]
J3  Servo 3  22-05-7038-03  [7395-03]
J4  Servo 4  22-05-7038-03  [7395-03]
J5  Servo 5  22-05-7038-03  [7395-03]
J6  Servo 6  22-05-7038-03  [7395-03]
J7  22-05-7028-02  [7395-02]
J8  22-05-7028-02  [7395-02]
J9  22-05-7028-02  [7395-02]
J10  22-05-7028-02  [7395-02]
J11  22-05-7028-02  [7395-02]
J12  22-05-7028-02  [7395-02]
J13  22-05-7048-04  [7395-04]

### Nets
GND: J13.1 J13.4 ; also sheet 1,2,3,4,5,6,9
OC1: J2.1 ; also sheet 6,9
OC2: J1.1 ; also sheet 6,9
OC3: J3.1 ; also sheet 6,9
OC4: J4.1 ; also sheet 6
OC5: J5.1 ; also sheet 6
OC6: J6.1 ; also sheet 6
VOUT_MOTOR: J13.2 J13.3 ; also sheet 4
VOUT_SERVOLEFT: C28.1 J4.2 J5.2 J6.2 ; also sheet 2
VOUT_SERVORIGHT: C27.1 J1.2 J2.2 J3.2 ; also sheet 5
VSS: C27.2 C28.2 J1.3 J2.3 J3.3 J4.3 J5.3 J6.3 ; also sheet 7
Unconnected: J7.1 J7.2 J8.1 J8.2 J9.1 J9.2 J10.1 J10.2 J11.1 J11.2 J12.1 J12.2

## Sheet 9 of 9
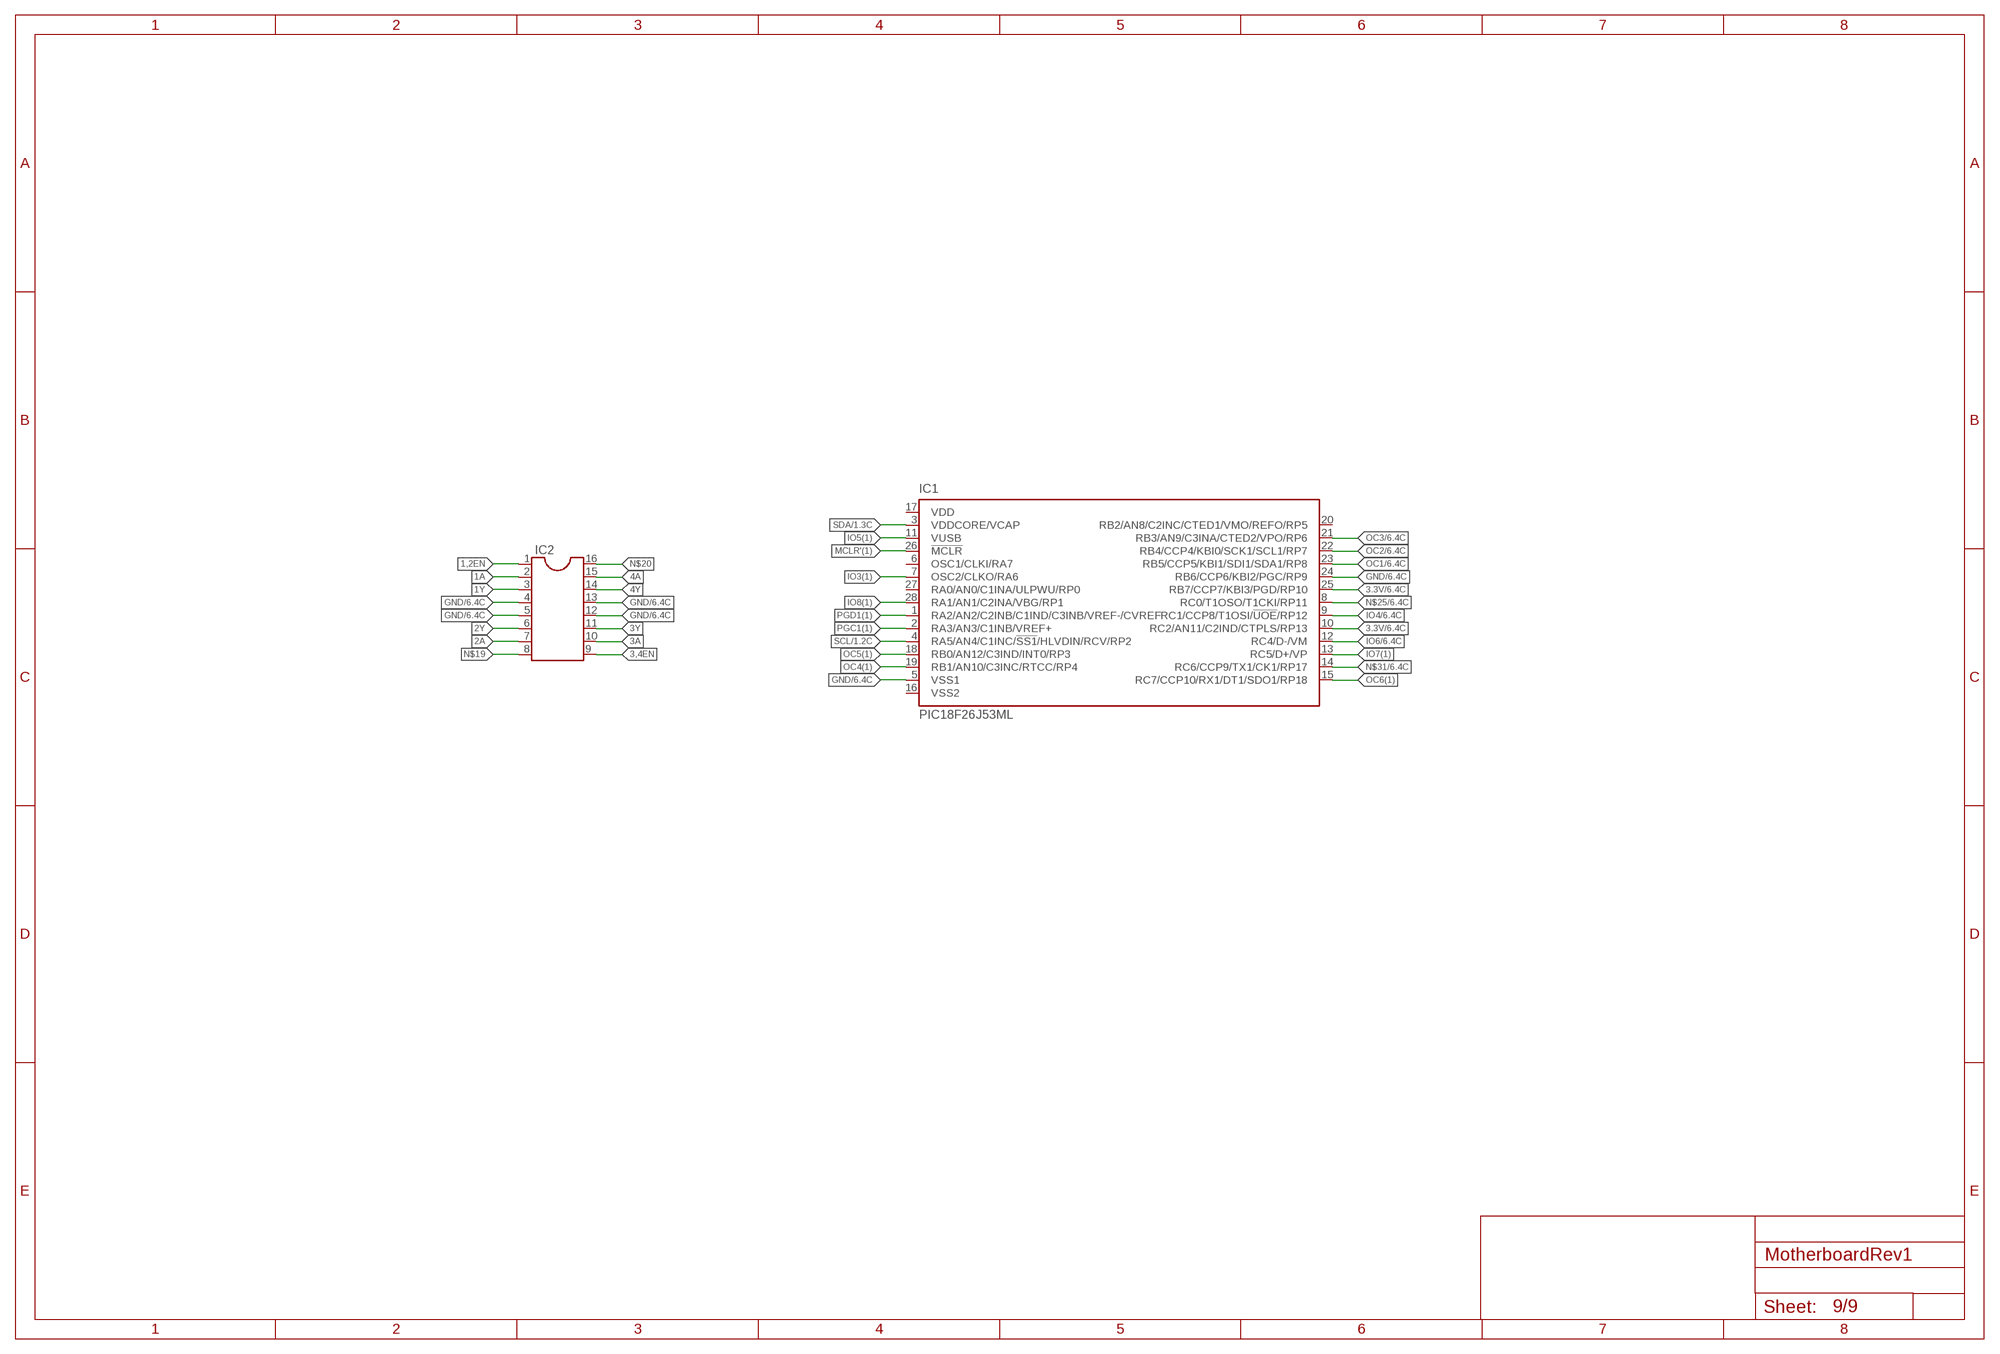
[diagram p8: schematic, sheet 9]

### Parts
IC1  PIC18F26J53ML  [QFN28-ML_6X6MM]
IC2  DIL16  [DIL16]

### Nets
1,2EN: IC2.1
1A: IC2.2
1Y: IC2.3
2A: IC2.7
2Y: IC2.6
3,4EN: IC2.9
3.3V: IC1.10(RC2/AN11/C2IND/CTPLS/RP13) IC1.25(RB7/CCP7/KBI3/PGD/RP10) ; also sheet 6,7
3A: IC2.10
3Y: IC2.11
4A: IC2.15
4Y: IC2.14
GND: IC1.5(VSS1) IC1.24(RB6/CCP6/KBI2/PGC/RP9) IC2.4 IC2.5 IC2.12 IC2.13 ; also sheet 1,2,3,4,5,6,8
IO3(1): IC1.7(OSC2/CLKO/RA6)
IO4: IC1.9(RC1/CCP8/T1OSI/!UOE!/RP12) ; also sheet 6
IO5(1): IC1.11(VUSB)
IO6: IC1.12(RC4/D-/VM) ; also sheet 6
IO7(1): IC1.13(RC5/D+/VP)
IO8(1): IC1.28(RA1/AN1/C2INA/VBG/RP1)
MCLR'(1): IC1.26(!MCLR)
N$19: IC2.8
N$20: IC2.16
N$25: IC1.8(RC0/T1OSO/T1CKI/RP11) ; also sheet 6
N$31: IC1.14(RC6/CCP9/TX1/CK1/RP17) ; also sheet 6
OC1: IC1.23(RB5/CCP5/KBI1/SDI1/SDA1/RP8) ; also sheet 6,8
OC2: IC1.22(RB4/CCP4/KBI0/SCK1/SCL1/RP7) ; also sheet 6,8
OC3: IC1.21(RB3/AN9/C3INA/CTED2/VPO/RP6) ; also sheet 6,8
OC4(1): IC1.19(RB1/AN10/C3INC/RTCC/RP4)
OC5(1): IC1.18(RB0/AN12/C3IND/INT0/RP3)
OC6(1): IC1.15(RC7/CCP10/RX1/DT1/SDO1/RP18)
PGC1(1): IC1.2(RA3/AN3/C1INB/VREF+)
PGD1(1): IC1.1(RA2/AN2/C2INB/C1IND/C3INB/VREF-/CVREF)
SCL: IC1.4(RA5/AN4/C1INC/!SS1!/HLVDIN/RCV/RP2) ; also sheet 1,6
SDA: IC1.3(VDDCORE/VCAP) ; also sheet 1,6
Unconnected: IC1.6(OSC1/CLKI/RA7) IC1.16(VSS2) IC1.17(VDD) IC1.20(RB2/AN8/C2INC/CTED1/VMO/REFO/RP5) IC1.27(RA0/AN0/C1INA/ULPWU/RP0)

## Library data of the parts
C1-C4 C7-C10 C13-C16 C19 C19' C20 C22 = 5v:GRM31CR71H475KA12L; CAP: 4.7E-6; ESR: 0.0; IRMS: 0.0; MANUFACTURER_NAME: MuRata; MANUFACTURER_PART_NUMBER: GRM31CR71H475KA12L; VDC: 50.0; VENDOR: MuRata
C5 C11 C17 C20' = 5v:C0805C103K5RACTU; CAP: 1.0E-8; ESR: 1.739; IRMS: 0.411; MANUFACTURER_NAME: Kemet; MANUFACTURER_PART_NUMBER: C0805C103K5RACTU; VDC: 50.0; VENDOR: Kemet
C6 C12 C18 C21' = 5v:10SVP330MX; CAP: 3.3E-4; DATASHEETURL: http://www.edc.sanyo.com/english/pdf/oscon/E32.pdf; ESR: 0.025; IRMS: 3.7; MANUFACTURER_NAME: Panasonic; MANUFACTURER_PART_NUMBER: 10SVP330MX; VDC: 10.0; VENDOR: Panasonic
C21 C25-C28 = rcl:C-US: CAPACITOR, American symbol
C23 C24 = SparkFun-Capacitors:10UF-16V-10%(TANT): CAP-00811 1206/EIA-3216 Tantalum capacitor; PROD_ID: CAP-00811
D1-D4 = 5v:PDS760-13; DATASHEETURL: www.diodes.com/datasheets/ds30477.pdf; IO: 7.0; MANUFACTURER_NAME: Diodes Inc.; MANUFACTURER_PART_NUMBER: PDS760-13; VENDOR: Diodes Inc.; VFATIO: 0.56; VRRM: 60.0
D5 D6 = SparkFun-LED:LED: LEDs Standard schematic elements and footprints for 5mm, 3mm, 1206, and 0603 sized LEDs. 5mm - Spark Fun Electronics SKU : COM-00529 (and others)
IC1 IC3 = microchip:PIC18F2*J53: PIC18F47J53 Family High-Performance USB Microcontrollers with nanoWatt XLP Technology Source: Data sheet <http://ww1.microchip.com/downloads/en/DeviceDoc/39964B.pdf>; MPN: PIC18F26J53-I/ML; OC_FARNELL: unknown; OC_NEWARK: 63R7829
IC2 = ic-package:DIL16: Dual In Line / Socket
J1-J6 = con-molex:22-?-03: CONNECTOR wire to board 2.54 mm (.1 inch) pitch header; OC_FARNELL: unknown; OC_NEWARK: unknown
J7-J12 = Son_of_Dark_Power:22-?-02: CONNECTOR wire to board 2.54 mm (.1 inch) pitch header; OC_FARNELL: 9731601; OC_NEWARK: unknown
J13 = Son_of_Dark_Power:22-?-04: CONNECTOR wire to board 2.54 mm (.1 inch) pitch header; OC_FARNELL: unknown; OC_NEWARK: unknown
L1-L4 = WE-HCC:WE-HCC: SMD High Current Cube Inductor WE-HCC - magnetically shieled - current capability up to 27A - excellent saturation characteristics -- filter choke for DC/DC converter -- single and polyphase buck converter -- filter choke for motor electronics; MPN: 7443331000; OC_FARNELL: 1848254; OC_NEWARK: 13T9771; PACKAGE: 1090; SUPPLIER: Wuerth Elektronik
LED1-LED4 = led:LED: LED OSRAM: - CHIPLED LG R971, LG N971, LY N971, LG Q971, LY Q971, LO R971, LY R971 LH N974, LH R974 LS Q976, LO Q976, LY Q976 LO Q996 - Hyper CHIPLED LW Q18S LB Q993, LB Q99A, LB R99A - SideLED LS A670, LO A670, LY A670, LG A670, LP A670 LB A673, LV A673, LT A673, LW A673 LH A674 LY A675 LS A676, LA A676, LO A676, LY A676, LW A676 LS A679, LY A679, LG A679 - Hyper Micro SIDELED® LS Y876, LA Y876, LO Y876, LY Y876 LT Y87S - SmartLED LW L88C, LW L88S LB L89C, LB L89S, LG L890 LS L89K, LO L89K, LY L89K LS L896, LA L896, LO L896, LY L896 - TOPLED LS T670, LO T670, LY T670, LG T670, LP T670 LSG T670, LSP T670, LSY T670, LOP T670, LYG T670 LG T671, LOG T671, LSG T671 LB T673, LV T673, LT T673, LW T673 LH T674 LS T676, LA T676, LO T676, LY T676, LB T676, LH T676, LSB T676, LW T676 LB T67C, LV T67C, LT T67C, LS T67K, LO T67K, LY T67K, LW E67C LS E67B, LA E67B, LO E67B, LY E67B, LB E67C, LV E67C, LT E67C LW T67C LS T679, LY T679, LG T679 LS T770, LO T770, LY T770, LG T770, LP T770 LB T773, LV T773, LT T773, LW T773 LH T774 LS E675, LA E675, LY E675, LS T675 LS T776, LA T776, LO T776, LY T776, LB T776 LHGB T686 LT T68C, LB T68C - Hyper Mini TOPLED® LB M676 - Mini TOPLED Santana® LG M470 LS M47K, LO M47K, LY M47K Source: http://www.osram.convergy.de LUXEON: - LUMILED® LXK2-PW12-R00, LXK2-PW12-S00, LXK2-PW14-U00, LXK2-PW14-V00 LXK2-PM12-R00, LXK2-PM12-S00, LXK2-PM14-U00 LXK2-PE12-Q00, LXK2-PE12-R00, LXK2-PE12-S00, LXK2-PE14-T00, LXK2-PE14-U00 LXK2-PB12-K00, LXK2-PB12-L00, LXK2-PB12-M00, LXK2-PB14-N00, LXK2-PB14-P00, LXK2-PB14-Q00 LXK2-PR12-L00, LXK2-PR12-M00, LXK2-PR14-Q00, LXK2-PR14-R00 LXK2-PD12-Q00, LXK2-PD12-R00, LXK2-PD12-S00 LXK2-PH12-R00, LXK2-PH12-S00 LXK2-PL12-P00, LXK2-PL12-Q00, LXK2-PL12-R00 Source: www.luxeon.com KINGBRIGHT: KA-3528ASYC Source: www.kingbright.com
LED5-LED9 = motherboard_i_autoroute:LED_LED: LED OSRAM: - CHIPLED LG R971, LG N971, LY N971, LG Q971, LY Q971, LO R971, LY R971 LH N974, LH R974 LS Q976, LO Q976, LY Q976 LO Q996 - Hyper CHIPLED LW Q18S LB Q993, LB Q99A, LB R99A - SideLED LS A670, LO A670, LY A670, LG A670, LP A670 LB A673, LV A673, LT A673, LW A673 LH A674 LY A675 LS A676, LA A676, LO A676, LY A676, LW A676 LS A679, LY A679, LG A679 - Hyper Micro SIDELED® LS Y876, LA Y876, LO Y876, LY Y876 LT Y87S - SmartLED LW L88C, LW L88S LB L89C, LB L89S, LG L890 LS L89K, LO L89K, LY L89K LS L896, LA L896, LO L896, LY L896 - TOPLED LS T670, LO T670, LY T670, LG T670, LP T670 LSG T670, LSP T670, LSY T670, LOP T670, LYG T670 LG T671, LOG T671, LSG T671 LB T673, LV T673, LT T673, LW T673 LH T674 LS T676, LA T676, LO T676, LY T676, LB T676, LH T676, LSB T676, LW T676 LB T67C, LV T67C, LT T67C, LS T67K, LO T67K, LY T67K, LW E67C LS E67B, LA E67B, LO E67B, LY E67B, LB E67C, LV E67C, LT E67C LW T67C LS T679, LY T679, LG T679 LS T770, LO T770, LY T770, LG T770, LP T770 LB T773, LV T773, LT T773, LW T773 LH T774 LS E675, LA E675, LY E675, LS T675 LS T776, LA T776, LO T776, LY T776, LB T776 LHGB T686 LT T68C, LB T68C - Hyper Mini TOPLED® LB M676 - Mini TOPLED Santana® LG M470 LS M47K, LO M47K, LY M47K Source: http://www.osram.convergy.de LUXEON: - LUMILED® LXK2-PW12-R00, LXK2-PW12-S00, LXK2-PW14-U00, LXK2-PW14-V00 LXK2-PM12-R00, LXK2-PM12-S00, LXK2-PM14-U00 LXK2-PE12-Q00, LXK2-PE12-R00, LXK2-PE12-S00, LXK2-PE14-T00, LXK2-PE14-U00 LXK2-PB12-K00, LXK2-PB12-L00, LXK2-PB12-M00, LXK2-PB14-N00, LXK2-PB14-P00, LXK2-PB14-Q00 LXK2-PR12-L00, LXK2-PR12-M00, LXK2-PR14-Q00, LXK2-PR14-R00 LXK2-PD12-Q00, LXK2-PD12-R00, LXK2-PD12-S00 LXK2-PH12-R00, LXK2-PH12-S00 LXK2-PL12-P00, LXK2-PL12-Q00, LXK2-PL12-R00 Source: www.luxeon.com KINGBRIGHT: KA-3528ASYC Source: www.kingbright.com
PROG. = con-molex:22-23-2061: .100" (2.54mm) Center Header - 6 Pin; MF: MOLEX; MPN: 22-23-2061; OC_FARNELL: 1462922; OC_NEWARK: 27C1933
Q1-Q4 = transistor-small-signal:BSS123: N-CHANNEL MOS FET
R1-R16 R19-R25 = rcl:R-US_: RESISTOR, American symbol
U1 U2 U$2 U$4 = 5v:TPS5450DDAR; DATASHEETURL: http://www.ti.com/product/tps5450; FREQUENCY: 500000.0; IMAX: 5.0; MANUFACTURER_NAME: Texas Instruments; MANUFACTURER_PART_NUMBER: TPS5450DDA; MKTG_PACKAGE: TPS5450; NSID: TPS5450DDAR; PACKAGE: TPS5450; VENDOR: Texas Instruments
U3 = NSC-LMS8117AMP:LMS8117AMP-3.3: Low-Dropout Linear Regulator; MPN: LMS8117AMP-3.3; OC_FARNELL: 1469032; OC_NEWARK: 41K3020; PACKAGE: SOT-223-3; SUPPLIER: National Semiconductor
U$1 = Son_of_Dark_Powersch:BEAGLE_BONE_BLACK_CAPE
U$5-U$7 = Parts4Class:MC32882_SW

## Net classes
0 default: width 0.203 mm, drill 0.508 mm, clearance 0.254 mm